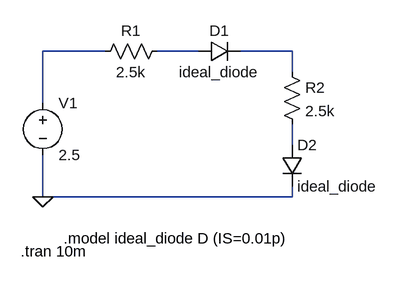
[diagram p0: schematic Q2.asc]
Q2.asc, the LTspice schematic file:
Version 4
SHEET 1 880 680
WIRE 112 48 16 48
WIRE 256 48 192 48
WIRE 400 48 320 48
WIRE 400 80 400 48
WIRE 16 128 16 48
WIRE 400 192 400 160
WIRE 16 272 16 208
WIRE 400 272 400 256
WIRE 400 272 16 272
FLAG 16 272 0
SYMBOL voltage 16 112 R0
WINDOW 123 0 0 Left 0
WINDOW 39 0 0 Left 0
SYMATTR InstName V1
SYMATTR Value 2.5
SYMBOL res 208 32 R90
WINDOW 0 0 56 VBottom 2
WINDOW 3 32 56 VTop 2
SYMATTR InstName R1
SYMATTR Value 2.5k
SYMBOL diode 256 64 R270
WINDOW 0 32 32 VTop 2
WINDOW 3 0 32 VBottom 2
SYMATTR InstName D1
SYMATTR Value ideal_diode
SYMBOL res 384 64 R0
SYMATTR InstName R2
SYMATTR Value 2.5k
SYMBOL diode 384 192 R0
SYMATTR InstName D2
SYMATTR Value ideal_diode
TEXT 48 336 Left 2 !.model ideal_diode D (IS=0.01p)
TEXT -18 356 Left 2 !.tran 10m

The netlist it stands for:
* Q2.asc
V1 N001 0 2.5
R1 N002 N001 2.5k
D1 N002 N003 ideal_diode
R2 N003 N004 2.5k
D2 N004 0 ideal_diode
.model D D
.lib standard.dio
.model ideal_diode D (IS=0.01p)
.tran 10m
.backanno
.end